# Altium schematic sheet drive.SchDoc
size A3
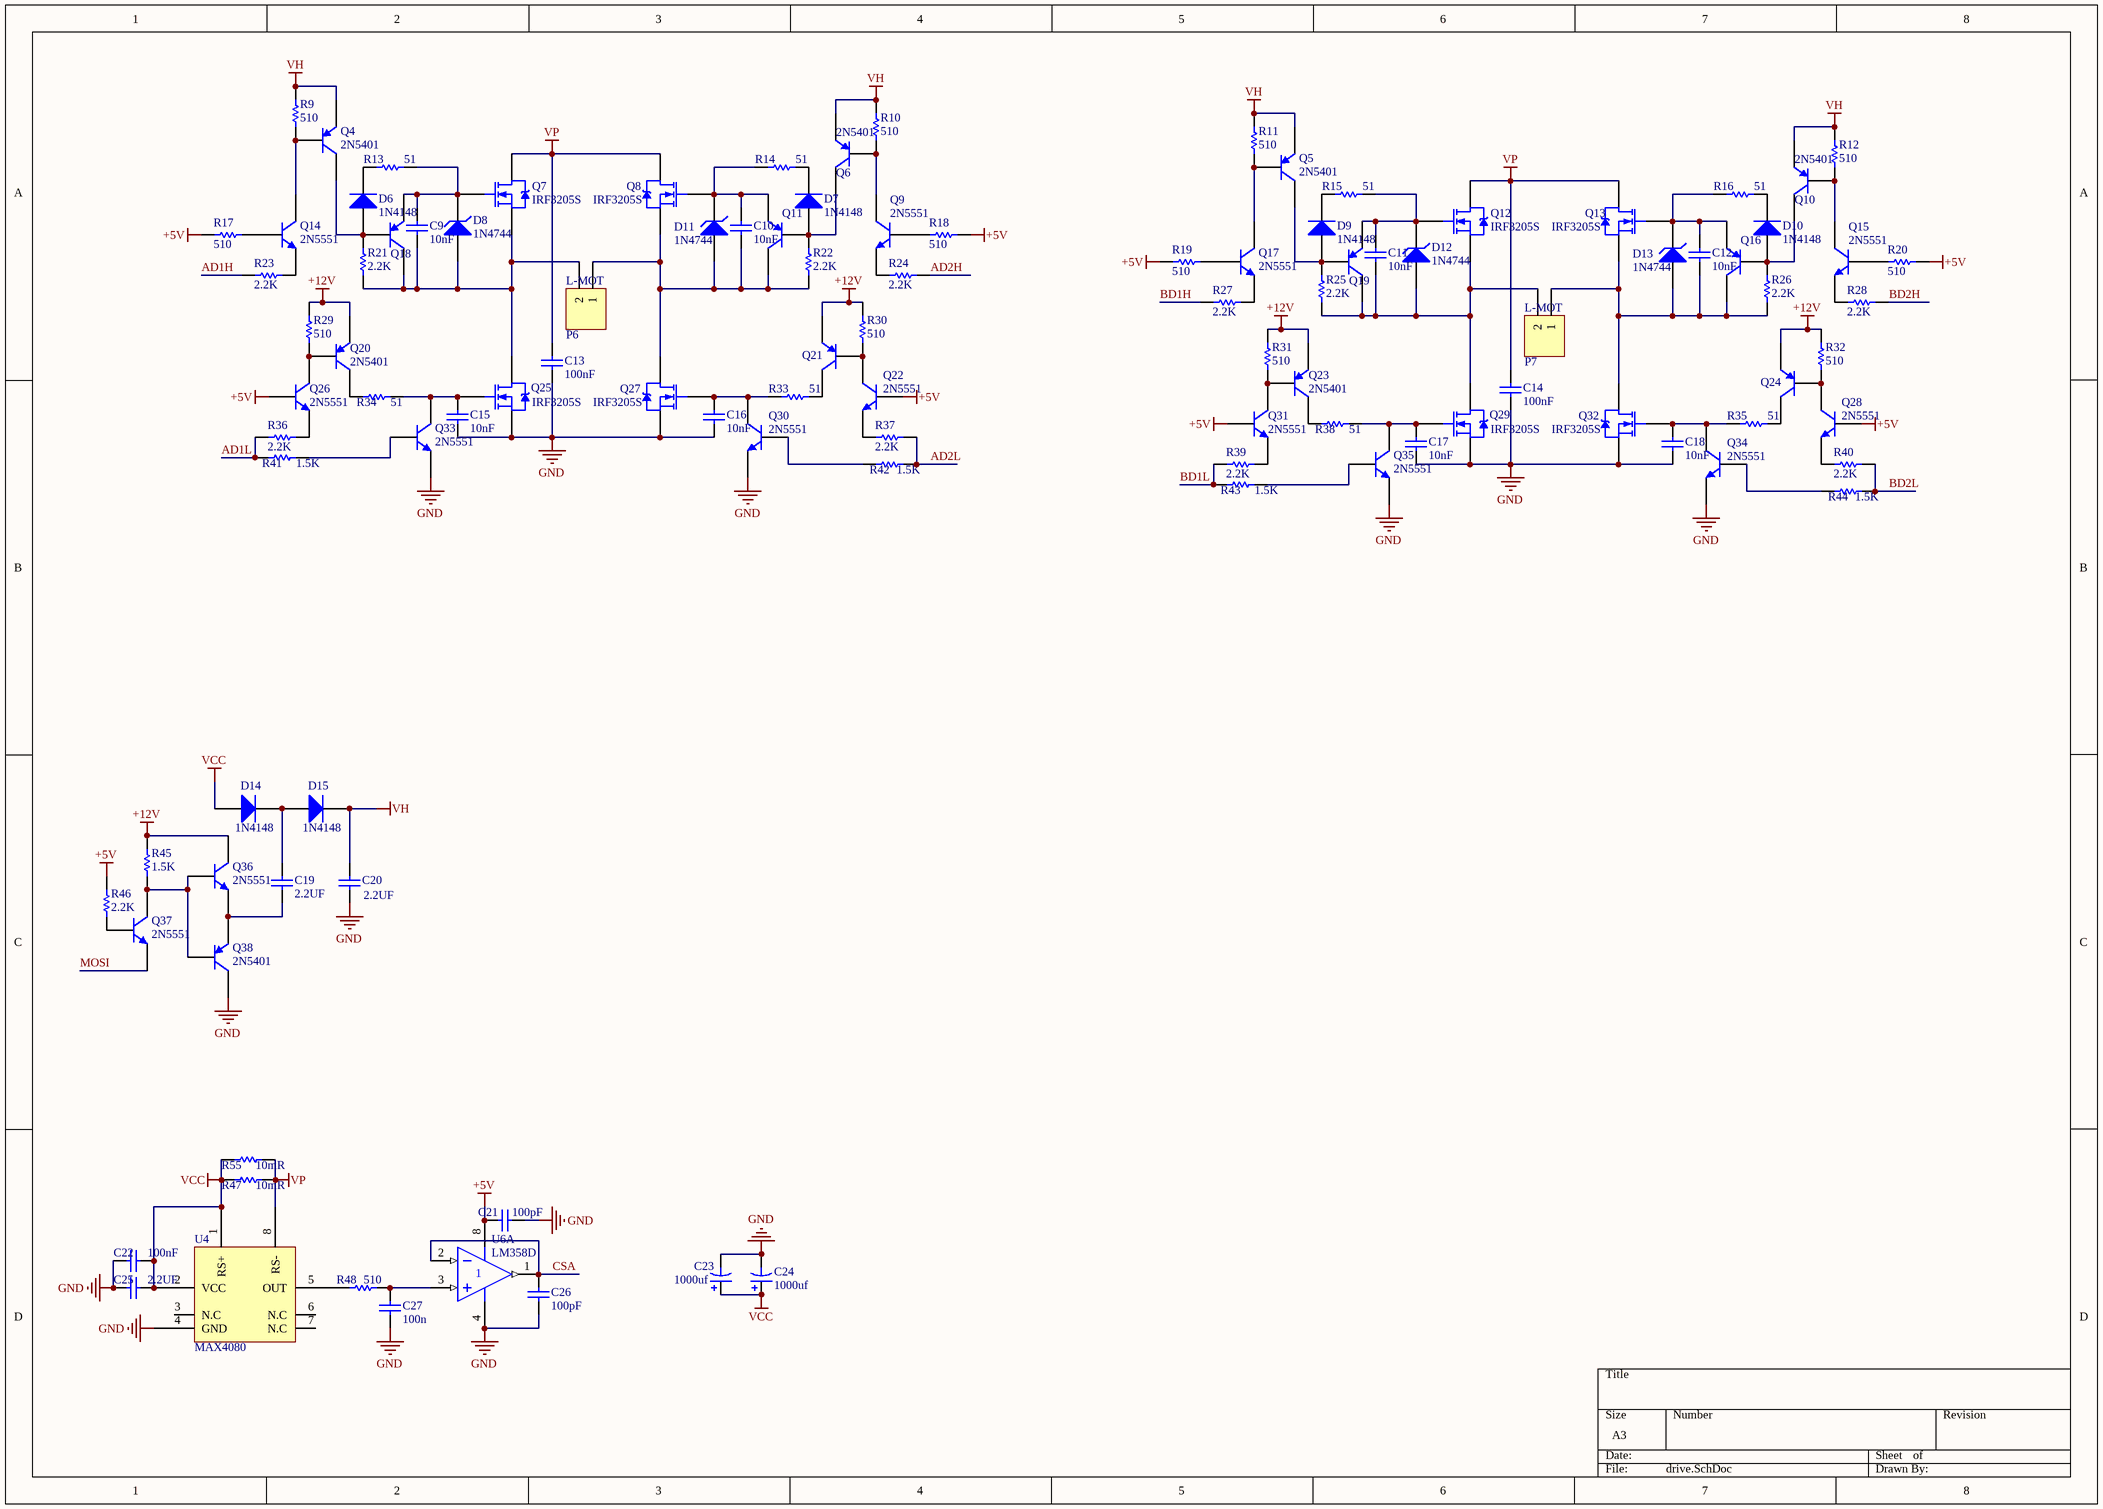
[diagram p0: drive.SchDoc]

## Parts
C9  value 10nF  [0603]  (hidden comment: Cap)
C10  value 10nF  [0603]  (hidden comment: Cap)
C11  value 10nF  [0603]  (hidden comment: Cap)
C12  value 10nF  [0603]  (hidden comment: Cap)
C13  value 100nF  [3216[1206]]  (hidden comment: Cap)
C14  value 100nF  [3216[1206]]  (hidden comment: Cap)
C15  value 10nF  [0603]  (hidden comment: Cap)
C16  value 10nF  [0603]  (hidden comment: Cap)
C17  value 10nF  [0603]  (hidden comment: Cap)
C18  value 10nF  [0603]  (hidden comment: Cap)
C19  value 2.2UF  [C1206]  (hidden comment: Cap)
C20  value 2.2UF  [C1206]  (hidden comment: Cap)
C21  value 100pF  [0603]  (hidden comment: Cap)
C22  value 100nF  [0603]  (hidden comment: Cap)
C23  value 1000uf  [C16-7.5]  (hidden comment: Cap Pol1)
C24  value 1000uf  [C16-7.5]  (hidden comment: Cap Pol1)
C25  value 2.2UF  [3216[1206]]  (hidden comment: Cap)
C26  value 100pF  [0603]  (hidden comment: Cap)
C27  value 100n  [0603]  (hidden comment: Cap)
D6  1N4148  [LL34]
D7  1N4148  [LL34]
D8  1N4744  [LL34]
D9  1N4148  [LL34]
D10  1N4148  [LL34]
D11  1N4744  [LL34]
D12  1N4744  [LL34]
D13  1N4744  [LL34]
D14  value 1N4148  [LL34]  (hidden comment: Diode)
D15  value 1N4148  [LL34]  (hidden comment: Diode)
P6  L-MOT  [MG7.62-2P]
P7  L-MOT  [MG7.62-2P]
Q4  2N5401  [SOT-23-PNP]
Q5  2N5401  [SOT-23-PNP]
Q6  2N5401  [SOT-23-PNP]
Q7  IRF3205S  [D2PAK-263]
Q8  IRF3205S  [D2PAK-263]
Q9  2N5551  [SOT-23-NPN]
Q10  2N5401  [SOT-23-PNP]
Q11  2N5401  [SOT-23-PNP]  (value not drawn)
Q12  IRF3205S  [D2PAK-263]
Q13  IRF3205S  [D2PAK-263]
Q14  2N5551  [SOT-23-NPN]
Q15  2N5551  [SOT-23-NPN]
Q16  2N5401  [SOT-23-PNP]  (value not drawn)
Q17  2N5551  [SOT-23-NPN]
Q18  2N5401  [SOT-23-PNP]  (value not drawn)
Q19  2N5401  [SOT-23-PNP]  (value not drawn)
Q20  2N5401  [SOT-23-PNP]
Q21  2N5401  [SOT-23-PNP]  (value not drawn)
Q22  2N5551  [SOT-23-NPN]
Q23  2N5401  [SOT-23-PNP]
Q24  2N5401  [SOT-23-PNP]  (value not drawn)
Q25  IRF3205S  [D2PAK-263]
Q26  2N5551  [SOT-23-NPN]
Q27  IRF3205S  [D2PAK-263]
Q28  2N5551  [SOT-23-NPN]
Q29  IRF3205S  [D2PAK-263]
Q30  2N5551  [SOT-23-NPN]
Q31  2N5551  [SOT-23-NPN]
Q32  IRF3205S  [D2PAK-263]
Q33  2N5551  [SOT-23-NPN]
Q34  2N5551  [SOT-23-NPN]
Q35  2N5551  [SOT-23-NPN]
Q36  value 2N5551  [SOT-23-NPN]  (hidden comment: NPN)
Q37  value 2N5551  [SOT-23-NPN]  (hidden comment: NPN)
Q38  value 2N5401  [SOT-23-PNP]  (hidden comment: PNP)
R9  value 510  [0603]  (hidden comment: Res1)
R10  value 510  [0603]  (hidden comment: Res1)
R11  value 510  [0603]  (hidden comment: Res1)
R12  value 510  [0603]  (hidden comment: Res1)
R13  value 51  [0603]  (hidden comment: Res1)
R14  value 51  [0603]  (hidden comment: Res1)
R15  value 51  [0603]  (hidden comment: Res1)
R16  value 51  [0603]  (hidden comment: Res1)
R17  value 510  [0603]  (hidden comment: Res1)
R18  value 510  [0603]  (hidden comment: Res1)
R19  value 510  [0603]  (hidden comment: Res1)
R20  value 510  [0603]  (hidden comment: Res1)
R21  value 2.2K  [0603]  (hidden comment: Res1)
R22  value 2.2K  [0603]  (hidden comment: Res1)
R23  value 2.2K  [0603]  (hidden comment: Res1)
R24  value 2.2K  [0603]  (hidden comment: Res1)
R25  value 2.2K  [0603]  (hidden comment: Res1)
R26  value 2.2K  [0603]  (hidden comment: Res1)
R27  value 2.2K  [0603]  (hidden comment: Res1)
R28  value 2.2K  [0603]  (hidden comment: Res1)
R29  value 510  [0603]  (hidden comment: Res1)
R30  value 510  [0603]  (hidden comment: Res1)
R31  value 510  [0603]  (hidden comment: Res1)
R32  value 510  [0603]  (hidden comment: Res1)
R33  value 51  [0603]  (hidden comment: Res1)
R34  value 51  [0603]  (hidden comment: Res1)
R35  value 51  [0603]  (hidden comment: Res1)
R36  value 2.2K  [0603]  (hidden comment: Res1)
R37  value 2.2K  [0603]  (hidden comment: Res1)
R38  value 51  [0603]  (hidden comment: Res1)
R39  value 2.2K  [0603]  (hidden comment: Res1)
R40  value 2.2K  [0603]  (hidden comment: Res1)
R41  value 1.5K  [0603]  (hidden comment: Res1)
R42  value 1.5K  [0603]  (hidden comment: Res1)
R43  value 1.5K  [0603]  (hidden comment: Res1)
R44  value 1.5K  [0603]  (hidden comment: Res1)
R45  value 1.5K  [0603]  (hidden comment: Res1)
R46  value 2.2K  [0603]  (hidden comment: Res1)
R47  value 10mR  [R15-1mm]
R48  value 510  [0603]  (hidden comment: Res1)
R55  value 10mR  [R15-1mm]
U4  MAX4080  [SOIC8]
U6  LM358D  [SOIC8]  (part A of 2)

## Nets
+5V: C21.2 Q22.2(B) Q26.2(B) Q28.2(B) Q31.2(B) R17.2 R18.2 R19.2 R20.2 R46.2 U6.8(V+)
+12V: Q20.1(E) Q21.1(E) Q23.1(E) Q24.1(E) Q36.3(C) R29.1 R30.1 R31.1 R32.1 R45.2
GND: C13.2 C14.2 C15.2 C16.2 C17.2 C18.2 C20.1 C21.1 C22.1 C23.2 C24.2 C25.2 C26.1 C27.1 Q25.3(S) Q27.3(S) Q29.3(S) Q30.1(E) Q32.3(S) Q33.1(E) Q34.1(E) Q35.1(E) Q38.3(C) U4.4(GND) U6.4(V-)
VCC: C22.2 C23.1 C24.1 C25.1 D14.1(A) R47.2 R55.2 U4.1(RS+) U4.2(VCC)
VH: C20.2 D15.2(K) Q4.1(E) Q5.1(E) Q6.1(E) Q10.1(E) R9.1 R10.1 R11.1 R12.1
VP: C13.1 C14.1 Q7.2(D) Q8.2(D) Q12.2(D) Q13.2(D) R47.1 R55.1 U4.8(RS-)
AD1H: R23.1
AD1L: R36.1 R41.2
AD2H: R24.2
AD2L: R37.2 R42.1
BD1H: R27.1
BD1L: R39.1 R43.2
BD2H: R28.2
BD2L: R40.2 R44.1
CSA: C26.2 U6.1(OUT) U6.2(IN-)
MOSI: Q37.1(E)
NetC9_1: C9.1 D8.2(K) Q7.1(G) Q18.1(E) R13.2
NetC9_2: C9.2 D8.1(A) P6.2 Q7.3(S) Q18.3(C) Q25.2(D) R21.1
NetC10_1: C10.1 D11.2(K) Q8.1(G) Q11.1(E) R14.1
NetC10_2: C10.2 D11.1(A) P6.1 Q8.3(S) Q11.3(C) Q27.2(D) R22.1
NetC11_1: C11.1 D12.2(K) Q12.1(G) Q19.1(E) R15.2
NetC11_2: C11.2 D12.1(A) P7.2 Q12.3(S) Q19.3(C) Q29.2(D) R25.1
NetC12_1: C12.1 D13.2(K) Q13.1(G) Q16.1(E) R16.1
NetC12_2: C12.2 D13.1(A) P7.1 Q13.3(S) Q16.3(C) Q32.2(D) R26.1
NetC15_1: C15.1 Q25.1(G) Q33.3(C) R34.2
NetC16_1: C16.1 Q27.1(G) Q30.3(C) R33.1
NetC17_1: C17.1 Q29.1(G) Q35.3(C) R38.2
NetC18_1: C18.1 Q32.1(G) Q34.3(C) R35.1
NetC19_1: C19.1 D14.2(K) D15.1(A)
NetC19_2: C19.2 Q36.1(E) Q38.1(E)
NetC27_2: C27.2 R48.1 U6.3(IN+)
NetD6_1: D6.1(A) Q4.3(C) Q18.2(B) R21.2
NetD6_2: D6.2(K) R13.1
NetD7_1: D7.1(A) Q6.3(C) Q11.2(B) R22.2
NetD7_2: D7.2(K) R14.2
NetD9_1: D9.1(A) Q5.3(C) Q19.2(B) R25.2
NetD9_2: D9.2(K) R15.1
NetD10_1: D10.1(A) Q10.3(C) Q16.2(B) R26.2
NetD10_2: D10.2(K) R16.2
NetQ4_2: Q4.2(B) Q14.3(C) R9.2
NetQ5_2: Q5.2(B) Q17.3(C) R11.2
NetQ6_2: Q6.2(B) Q9.3(C) R10.2
NetQ9_1: Q9.1(E) R24.1
NetQ9_2: Q9.2(B) R18.1
NetQ10_2: Q10.2(B) Q15.3(C) R12.2
NetQ14_1: Q14.1(E) R23.2
NetQ14_2: Q14.2(B) R17.1
NetQ15_1: Q15.1(E) R28.1
NetQ15_2: Q15.2(B) R20.1
NetQ17_1: Q17.1(E) R27.2
NetQ17_2: Q17.2(B) R19.1
NetQ20_2: Q20.2(B) Q26.3(C) R29.2
NetQ20_3: Q20.3(C) R34.1
NetQ21_2: Q21.2(B) Q22.3(C) R30.2
NetQ21_3: Q21.3(C) R33.2
NetQ22_1: Q22.1(E) R37.1
NetQ23_2: Q23.2(B) Q31.3(C) R31.2
NetQ23_3: Q23.3(C) R38.1
NetQ24_2: Q24.2(B) Q28.3(C) R32.2
NetQ24_3: Q24.3(C) R35.2
NetQ26_1: Q26.1(E) R36.2
NetQ28_1: Q28.1(E) R40.1
NetQ30_2: Q30.2(B) R42.2
NetQ31_1: Q31.1(E) R39.2
NetQ33_2: Q33.2(B) R41.1
NetQ34_2: Q34.2(B) R44.2
NetQ35_2: Q35.2(B) R43.1
NetQ36_2: Q36.2(B) Q37.3(C) Q38.2(B) R45.1
NetQ37_2: Q37.2(B) R46.1
NetR48_2: R48.2 U4.5(OUT)

Not connected (* = marked no-connect by the designer): U4 3(N.C) 6(N.C) 7(N.C)

## Library data of the parts
C9-C22 C25-C27 = Cap: Capacitor; Published: 8-Jun-2000; LatestRevisionDate: 17-Jul-2002; LatestRevisionNote: Re-released for DXP Platform.; PackageReference: RAD-0.3; Publisher: Altium Limited
C23 C24 = Cap Pol1: Polarized Capacitor (Radial); Published: 8-Jun-2000; LatestRevisionDate: 17-Jul-2002; LatestRevisionNote: Re-released for DXP Platform.; PackageReference: RB7.6-15; Publisher: Altium Limited
D6 D7 D9 D10 = Diode 1N4148: High Conductance Fast Diode; Published: 8-Jun-2000; LatestRevisionDate: 17-Jul-2002; LatestRevisionNote: Re-released for DXP Platform.; DatasheetDocument: 1997; PackageReference: DO-35; Publisher: Altium Limited; Code_JEDEC: DO-204-AH; ComponentLink1Description: Manufacturer Link; ComponentLink1URL: http://www.fairchildsemi.com/; ComponentLink2Description: Datasheet; ComponentLink2URL: http://www.fairchildsemi.com/ds/1N%2F1N4148.pdf
D8 D11-D13 = D Zener: Zener Diode; Published: 8-Jun-2000; LatestRevisionDate: 17-Jul-2002; LatestRevisionNote: Re-released for DXP Platform.; PackageReference: DIODE-0.7; Publisher: Altium Limited
D14 D15 = Diode 1N5408: 3 Amp Medium Power Silicon Rectifier Diode; Published: 8-Jun-2000; LatestRevisionDate: 17-Jul-2002; LatestRevisionNote: Re-released for DXP Platform.; DatasheetDocument: Aug-1984; PackageReference: DO-201AD; Publisher: Altium Limited; ComponentLink1Description: Manufacturer Link; ComponentLink1URL: http://www.irf.com/
P6 P7 = Header 2: Header, 2-Pin; LatestRevisionDate: 17-Jul-2002; LatestRevisionNote: Re-released for DXP Platform.; Publisher: Altium Limited
Q4-Q6 Q10 Q11 Q16 Q18-Q21 Q23 Q24 Q38 = 2N5401: PNP General Purpose Amplifier; Published: 8-Jun-2000; LatestRevisionDate: 17-Jan-2003; LatestRevisionNote: PCB Footprint 'BCY-W3/D4.7' replaced; DatasheetDocument: 1997; PackageDocument: Sep-1998; PackageReference: TO-92A; Publisher: Altium Limited; ComponentLink1Description: Manufacturer Link; ComponentLink1URL: http://www.fairchildsemi.com/; ComponentLink2Description: Datasheet; ComponentLink2URL: http://www.fairchildsemi.com/ds/2N%2F2N5401.pdf
Q7 Q8 Q12 Q13 Q25 Q27 Q29 Q32 = IRF3205S: HEXFET Power MOSFET; Published: 8-Jun-2000; LatestRevisionDate: 17-Jul-2002; LatestRevisionNote: Re-released for DXP Platform.; DatasheetVersion: Aug-1997; PackageReference: D2PAK; Publisher: Altium Limited; PackageDescription: D2-PAK/TO-263-AB; 3 Leads (1 Cropped); Body 15.5 (inc. leads) x 10.5 mm (LxW max); ComponentLink1Description: Manufacturer Link; ComponentLink1URL: http://www.irf.com/; ComponentLink2Description: Datasheet; ComponentLink2URL: http://www.irf.com/product-info/datasheets/data/irf3205s.pdf
Q9 Q14 Q15 Q17 Q22 Q26 Q28 Q30 Q31 Q33-Q37 = 2N5551: NPN General Purpose Amplifier; Published: 8-Jun-2000; LatestRevisionDate: 17-Jan-2003; LatestRevisionNote: PCB Footprint 'BCY-W3/D4.7' replaced; DatasheetDocument: 1997; PackageDocument: Sep-1998; PackageReference: TO-92A; Publisher: Altium Limited; ComponentLink1Description: Manufacturer Link; ComponentLink1URL: http://www.fairchildsemi.com/; ComponentLink2Description: Datasheet; ComponentLink2URL: http://www.fairchildsemi.com/ds/2N%2F2N5551.pdf
R9-R48 R55 = Res1: Resistor; Published: 8-Jun-2000; LatestRevisionDate: 17-Jul-2002; LatestRevisionNote: Re-released for DXP Platform.; PackageReference: AXIAL-0.3; Publisher: Altium Limited
U6 = LM358D: Dual Low-Power Operational Amplifier; Published: 17-Jul-2002; LatestRevisionDate: 13-Apr-2006; LatestRevisionNote: IPC-7351 Footprint Added.; DatasheetVersion: 1988; PackageReference: 751-02; Publisher: Altium Limited; PackageDescription: 8-Pin Small Outline Integrated Circuit 1.27 mm Pitch; Code_JEDEC: MS-012-AA; Code_IPC: SOIC127P600-8; ComponentLink1Description: Manufacturer Link; ComponentLink1URL: http://www.onsemi.com/site/products/parametrics/0,4446,251,00.html; ComponentLink2Description: Datasheet; ComponentLink2URL: http://www.onsemi.com/pub/Collateral/LM358-D.PDF